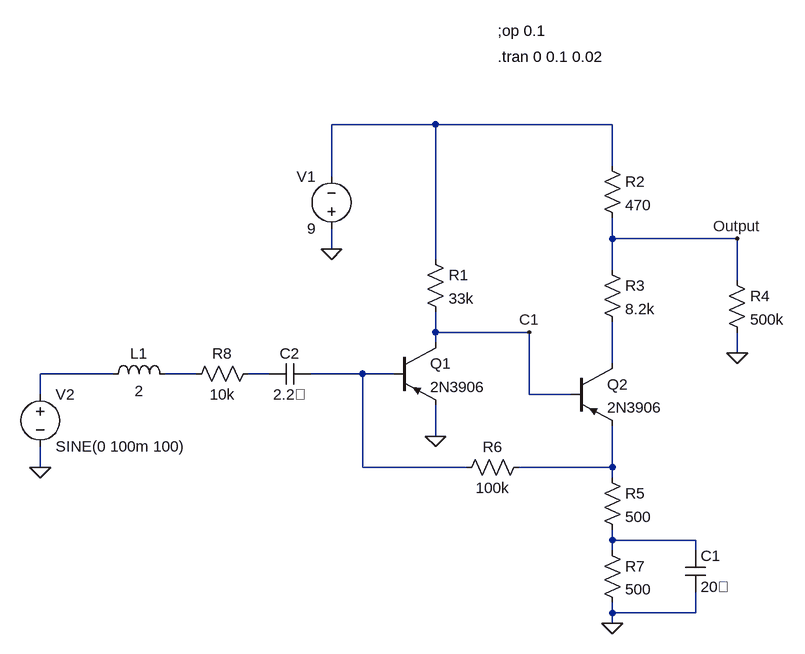
[diagram p0: schematic fuzz_face.asc]
fuzz_face.asc, the LTspice schematic file:
Version 4
SHEET 1 1860 680
WIRE 112 -448 -48 -448
WIRE 384 -448 112 -448
WIRE 384 -384 384 -448
WIRE -48 -368 -48 -448
WIRE 384 -272 384 -304
WIRE 576 -272 384 -272
WIRE -48 -256 -48 -288
WIRE 112 -240 112 -448
WIRE 384 -224 384 -272
WIRE 576 -208 576 -272
WIRE 112 -128 112 -160
WIRE 256 -128 112 -128
WIRE 112 -112 112 -128
WIRE 576 -96 576 -128
WIRE 384 -80 384 -144
WIRE -384 -64 -496 -64
WIRE -256 -64 -304 -64
WIRE -144 -64 -176 -64
WIRE 0 -64 -80 -64
WIRE 48 -64 0 -64
WIRE -496 -32 -496 -64
WIRE 256 -32 256 -128
WIRE 320 -32 256 -32
WIRE 112 32 112 -16
WIRE -496 80 -496 48
WIRE 0 80 0 -64
WIRE 160 80 0 80
WIRE 384 80 384 16
WIRE 384 80 240 80
WIRE 384 96 384 80
WIRE 384 192 384 176
WIRE 512 192 384 192
WIRE 384 208 384 192
WIRE 512 208 512 192
WIRE 384 304 384 288
WIRE 512 304 512 272
WIRE 512 304 384 304
WIRE 384 320 384 304
FLAG -48 -256 0
FLAG 576 -96 0
FLAG 384 320 0
FLAG -496 80 0
FLAG 112 32 0
FLAG 576 -272 Output
FLAG 256 -128 C1
SYMBOL voltage -48 -272 R180
WINDOW 0 24 96 Left 2
WINDOW 3 24 16 Left 2
WINDOW 123 0 0 Left 2
WINDOW 39 0 0 Left 2
SYMATTR InstName V1
SYMATTR Value 9
SYMBOL res 96 -256 R0
SYMATTR InstName R1
SYMATTR Value 33k
SYMBOL res 368 -400 R0
SYMATTR InstName R2
SYMATTR Value 470
SYMBOL res 368 -240 R0
SYMATTR InstName R3
SYMATTR Value 8.2k
SYMBOL res 560 -224 R0
SYMATTR InstName R4
SYMATTR Value 500k
SYMBOL res 368 80 R0
SYMATTR InstName R5
SYMATTR Value 500
SYMBOL res 144 96 R270
WINDOW 0 32 56 VTop 2
WINDOW 3 0 56 VBottom 2
SYMATTR InstName R6
SYMATTR Value 100k
SYMBOL pnp 48 -112 R0
SYMATTR InstName Q1
SYMATTR Value 2N3906
SYMBOL pnp 320 -80 R0
SYMATTR InstName Q2
SYMATTR Value 2N3906
SYMBOL cap 496 208 R0
SYMATTR InstName C1
SYMATTR Value 20ต
SYMBOL cap -144 -48 R270
WINDOW 0 32 32 VTop 2
WINDOW 3 0 32 VBottom 2
SYMATTR InstName C2
SYMATTR Value 2.2ต
SYMBOL voltage -496 -48 R0
WINDOW 123 0 0 Left 2
WINDOW 39 0 0 Left 2
SYMATTR InstName V2
SYMATTR Value SINE(0 100m 100)
SYMBOL res 368 192 R0
SYMATTR InstName R7
SYMATTR Value 500
SYMBOL res -272 -48 R270
WINDOW 0 32 56 VTop 2
WINDOW 3 0 56 VBottom 2
SYMATTR InstName R8
SYMATTR Value 10k
SYMBOL ind -400 -48 R270
WINDOW 0 32 56 VTop 2
WINDOW 3 5 56 VBottom 2
SYMATTR InstName L1
SYMATTR Value 2
TEXT 208 -592 Left 2 !;op 0.1
TEXT 208 -552 Left 2 !.tran 0 0.1 0.02

The netlist it stands for:
* fuzz_face.asc
V1 0 N001 9
R1 N001 C1 33k
R2 N001 Output 470
R3 Output N002 8.2k
R4 Output 0 500k
R5 N007 N008 500
R6 N006 N007 100k
Q1 C1 N006 0 0 2N3906
Q2 N002 C1 N007 0 2N3906
C1 N008 0 20ต
C2 N005 N006 2.2ต
V2 N003 0 SINE(0 100m 100)
R7 N008 0 500
R8 N004 N005 10k
L1 N003 N004 2
.model NPN NPN
.model PNP PNP
.lib standard.bjt
;op 0.1
.tran 0 0.1 0.02
.backanno
.end